# Altium schematic sheet ADC_DAC_Supply.SchDoc: RFSoC AMC
size 420 x 297 mm; CompanyName: WUT; DrawnBy: T. Przywozki; Organization: WUT ISE; Address1: Warsaw University of Technology; Address2: Nowowiejska 15/19 00-665 Warsaw; Address3: Tomasz.Przywozki@pw.edu.pl; DocumentNumber: 35; Revision: 1; SheetNumber: 35; SheetTotal: 45; Project: RFSoC AMC; ModifiedBy: T. Przywozki; CreateDate: -; CheckedDate: -; DivGrp: ISE; Designer: T. Przywozki; ModifiedDate: -; ProjectName: ADC/DAC MEZZANINE
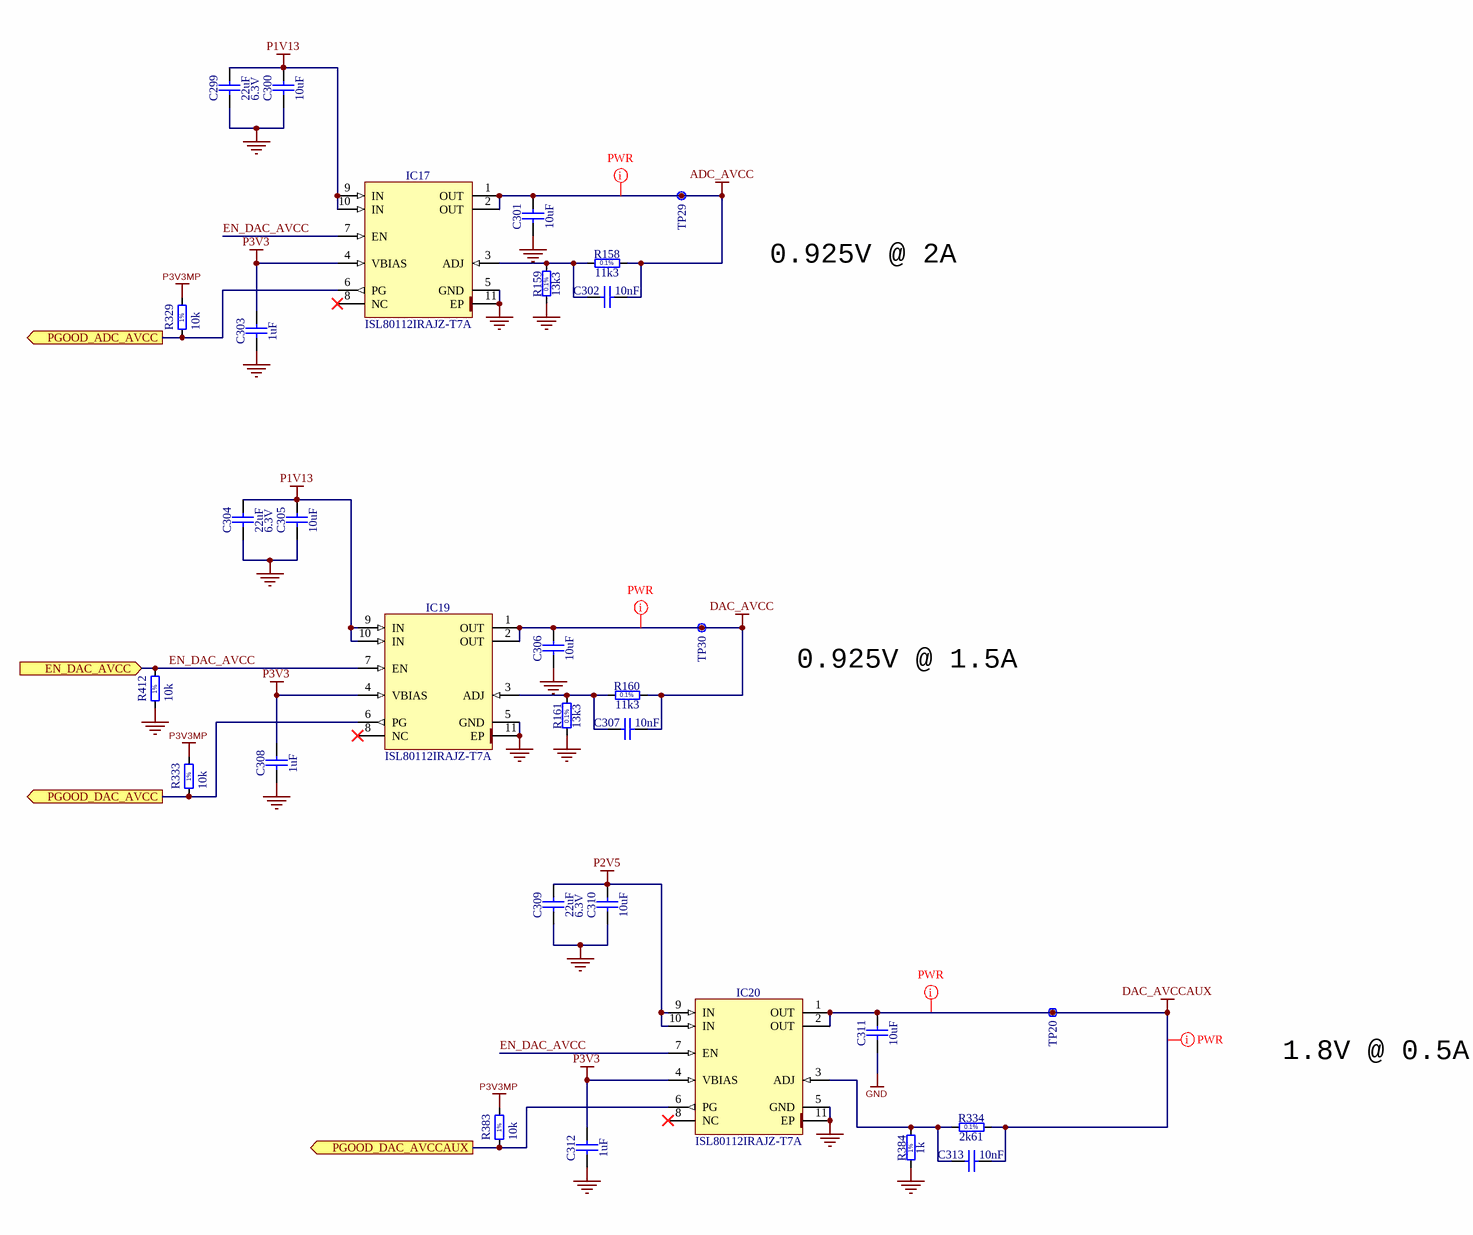
[diagram p0: ADC_DAC_Supply.SchDoc]

## Parts
C299  22uF  Voltage: 6.3V  [CAPC1709X100N]
C300  10uF  [CAPC1608X80N]
C301  10uF  [CAPC1608X80N]
C302  10nF  [CAPC1005X55N]
C303  1uF  [CAPC1005X55N]
C304  22uF  Voltage: 6.3V  [CAPC1709X100N]
C305  10uF  [CAPC1608X80N]
C306  10uF  [CAPC1608X80N]
C307  10nF  [CAPC1005X55N]
C308  1uF  [CAPC1005X55N]
C309  22uF  Voltage: 6.3V  [CAPC1709X100N]
C310  10uF  [CAPC1608X80N]
C311  10uF  [CAPC1608X80N]
C312  1uF  [CAPC1005X55N]
C313  10nF  [CAPC1005X55N]
IC17  ISL80112IRAJZ-T7A  [RENESAS_L10.3X3]
IC19  ISL80112IRAJZ-T7A  [RENESAS_L10.3X3]
IC20  ISL80112IRAJZ-T7A  [RENESAS_L10.3X3]
R158  11k3  [RESC2012X60N]
R159  13k3  [RESC2012X60N]
R160  11k3  [RESC2012X60N]
R161  13k3  [RESC2012X60N]
R329  10k  [RESC1005X40N]
R333  10k  [RESC1005X40N]
R334  2k61  [RESC1608X55N]
R383  10k  [RESC1005X40N]
R384  1k  [RESC1608X55N]
R412  10k  [RESC1005X40N]
TP20  Test Point  [TPS127]  (value not drawn)
TP29  Test Point  [TPS127]  (value not drawn)
TP30  Test Point  [TPS127]  (value not drawn)

## Ports
EN_DAC_AVCC (in), PGOOD_ADC_AVCC (out), PGOOD_DAC_AVCC (out), PGOOD_DAC_AVCCAUX (out)

## Nets
ADC_AVCC: C301.2 C302.2 IC17.1(OUT) IC17.2(OUT) R158.2 TP29.1
DAC_AVCC: C306.2 C307.2 IC19.1(OUT) IC19.2(OUT) R160.2 TP30.1
DAC_AVCCAUX: C311.2 C313.2 IC20.1(OUT) IC20.2(OUT) R334.2 TP20.1
GND: C299.1 C300.1 C301.1 C303.1 C304.1 C305.1 C306.1 C308.1 C309.1 C310.1 C311.1 C312.1 IC17.5(GND) IC17.11(EP) IC19.5(GND) IC19.11(EP) IC20.5(GND) IC20.11(EP) R159.1 R161.1 R384.1 R412.1
P1V13: C299.2 C300.2 C304.2 C305.2 IC17.9(IN) IC17.10(IN) IC19.9(IN) IC19.10(IN)
P2V5: C309.2 C310.2 IC20.9(IN) IC20.10(IN)
P3V3: C303.2 C308.2 C312.2 IC17.4(VBIAS) IC19.4(VBIAS) IC20.4(VBIAS)
P3V3MP: R329.2 R333.2 R383.2
EN_DAC_AVCC: IC17.7(EN) IC19.7(EN) IC20.7(EN) R412.2 ; port EN_DAC_AVCC
PGOOD_ADC_AVCC: IC17.6(PG) R329.1 ; port PGOOD_ADC_AVCC
PGOOD_DAC_AVCC: IC19.6(PG) R333.1 ; port PGOOD_DAC_AVCC
PGOOD_DAC_AVCCAUX: IC20.6(PG) R383.1 ; port PGOOD_DAC_AVCCAUX
NetC302_1: C302.1 IC17.3(ADJ) R158.1 R159.2
NetC307_1: C307.1 IC19.3(ADJ) R160.1 R161.2
NetC313_1: C313.1 IC20.3(ADJ) R334.1 R384.2

Not connected (* = marked no-connect by the designer): IC17 8(NC)*; IC19 8(NC)*; IC20 8(NC)*

## Layout directives
net class PWR: ADC_AVCC, DAC_AVCC, DAC_AVCCAUX

## Notes on the sheet
- 0.925V @ 2A
- 0.925V @ 1.5A
- 1.8V @ 0.5A
- Project/Equipment
- Document
- Designer
- Drawn by
- Check.by
- Copyright WUT ISE 2021
  This documentation describes Open Hardware and is licensed under CERN OHL v.1.1. You may redistribute and modify this documentaction under the terms of the CERN OHL v1.1.
  (http://ohwr.org/CERNOHL). This documentation is dristributed WITHOUT ANY EXPRESS OR IMPLIED WARRANTY, INCLUDING OF MERCHANTABLITY, SATISFACTORY QUALITY AND FITNESS FOR A PARTICULAR PURPOSE. Please see the CERN OHL v.1.1 for applicable conditions
- File
- Last Mod.
- Print Date
- Sheet
- Size
- A3
- of
- Rev
- Contact:
- (in symbol R0402_10K_1%_0.0625W_100PPM) 1%
- (in symbol R0603_1K_1%_0.1W_100PPM) 1%
- (in symbol R0603_2K61_0.1%_0.063W_10PPM) 0.1%
- (in symbol R0805_11K3_0.1%_0.1W_10PPM) 0.1%
- (in symbol R0805_13K3_0.1%_0.1W_10PPM) 0.1%

## Library data of the parts
C299 C304 C309 = CC0603_22UF_6.3V_20%_X5R: Non-polarised capacitor; Part Description: SMD Multilayer Chip Ceramic Capacitor; Manufacturer: GENERIC; Manufacturer1 Part Number: C1608X5R0J226M080AC; TC: X5R; Tolerance: ±20%; Part Number: CC0603_22UF_6.3V_20%_X5R; Component Kind: Standard; Component Type: Standard; Pin Count: 2; Value: 22uF; Status: None; Manufacturer Part Number: CC0603_22UF_6.3V_20%_X5R; Case: 0603; Mounted: Yes; Socket: No; SMD: Yes; Sense: No; Manufacturer1 Example: TDK; Manufacturer1 ComponentHeight: 1mm; HelpURL: \\cern.ch\dfs\Applications\Altium\Datasheets\CC0603_X5R_TDK_C.pdf; Author: CERN DEM JLC; CreateDate: 16.12.2013; LatestRevisionDate: 13.09.2016
C300 C301 C305 C306 C310 C311 = CC0603_10UF_10V_10%_X5R: Non-polarised capacitor; Part Description: SMD Multilayer Chip Ceramic Capacitor; Manufacturer: GENERIC; Manufacturer1 Part Number: GRM188R61A106KE69D; Voltage: 10V; TC: X5R; Tolerance: ±10%; Part Number: CC0603_10UF_10V_10%_X5R; Component Kind: Standard; Component Type: Standard; Pin Count: 2; Value: 10uF; Status: None; Manufacturer Part Number: CC0603_10UF_10V_10%_X5R; Case: 0603; Mounted: Yes; Socket: No; SMD: Yes; Sense: No; Manufacturer1 Example: MURATA; Manufacturer1 ComponentHeight: 0.8mm; HelpURL: \\cern.ch\dfs\Applications\Altium\Datasheets\CC0603_MURATA_GRM188R61A106KE69D.pdf; Author: CERN DEM JLC; CreateDate: 31.01.2017; LatestRevisionDate: 31.01.2017
C302 C307 C313 = CC0402_10NF_25V_10%_X7R: Non-polarised capacitor; Part Description: SMD Multilayer Chip Ceramic Capacitor; Manufacturer: GENERIC; Manufacturer1 Part Number: C1005X7R1E103KT; Voltage: 25V; TC: X7R; Tolerance: ±10%; Part Number: CC0402_10NF_25V_10%_X7R; Component Kind: Standard; Component Type: Standard; Pin Count: 2; Value: 10nF; Status: Preferred; Manufacturer Part Number: CC0402_10NF_25V_10%_X7R; Case: 0402; Mounted: Yes; Socket: No; SMD: Yes; Sense: No; Manufacturer1 Example: TDK; Manufacturer1 ComponentHeight: 0.55mm; HelpURL: \\cern.ch\dfs\Applications\Altium\Datasheets\CC0402_X7R_TDK_C.pdf; Author: CERN DEM JLC; CreateDate: 25.10.2012; LatestRevisionDate: 25.10.2012
C303 C308 C312 = CC0402_1UF_16V_10%_X5R: Non-polarised capacitor; Part Description: SMD Multilayer Chip Ceramic Capacitor; Manufacturer: GENERIC; Manufacturer1 Part Number: C1005X5R1C105KT; Voltage: 16V; TC: X5R; Tolerance: ±10%; Part Number: CC0402_1UF_16V_10%_X5R; Component Kind: Standard; Component Type: Standard; Pin Count: 2; Value: 1uF; Status: Preferred; Manufacturer Part Number: CC0402_1UF_16V_10%_X5R; Case: 0402; Mounted: Yes; Socket: No; SMD: Yes; Sense: No; Manufacturer1 Example: TDK; Manufacturer1 ComponentHeight: 0.55mm; HelpURL: \\cern.ch\dfs\Applications\Altium\Datasheets\CC0402_X5R_TDK_C.pdf; Author: CERN DEM JLC; CreateDate: 25.10.2012; LatestRevisionDate: 25.10.2012
IC17 IC19 IC20 = ISL80112IRAJZ-T7A: Ultra Low Dropout Low Input Voltage NMOS LDO Regulator; Part Description: 1V-3.6V to 0.8V-3.3V Ultra Low Dropout 2A Low Input Voltage NMOS LDO Regulator; Manufacturer: RENESAS ELECTRONICS; PressFit: No; Bonding: No; Part Number: ISL80112IRAJZ-T7A; Component Kind: Standard; Component Type: Standard; Device: ISL80112IRAJZ-T7A; PackageDescription: SON(DFN), 0.50mm Pitch, Square; 10 Pin, 3.00mm L X 3.00mm W X 1.00mm H body (w/Thermal Tab 1.60 x2.00mm); Manufacturer Part Number: ISL80112IRAJZ-T7A; Pin Count: 11; Case: SON10; Mounted: Yes; Socket: No; SMD: Yes; Sense: No; ComponentHeight: 1mm; HelpURL: \\cern.ch\dfs\Applications\Altium\Datasheets\ISL80112IRAJZ-T7A.pdf; Author: CERN DEM JLC; CreateDate: 04.12.2018; LatestRevisionDate: 04.12.2018
R158 R160 = R0805_11K3_0.1%_0.1W_10PPM: Resistor - 0.1%; Part Description: Thin Film Chip Resistor; Manufacturer: GENERIC; Manufacturer1 Part Number: RN73C2A11K3BTG; Power: 0.1W; TC: ±10ppm; PressFit: No; Part Number: R0805_11K3_0.1%_0.1W_10PPM; Component Kind: Standard; Component Type: Standard; Pin Count: 2; Value: 11k3; Status: Not Recommended; Tolerance: ±0.1%; Manufacturer Part Number: R0805_11K3_0.1%_0.1W_10PPM; Case: 0805; Mounted: Yes; Sense: No; Socket: No; SMD: Yes; Manufacturer1 Example: TYCO HOLSWORTHY; Manufacturer1 ComponentHeight: 0.6mm; HelpURL: \\cern.ch\dfs\Applications\Altium\Datasheets\R0805_Tyco_RN73.pdf; Author: CERN DEM JLC; CreateDate: 03.12.2007; LatestRevisionDate: 13.03.2008
R159 R161 = R0805_13K3_0.1%_0.1W_10PPM: Resistor - 0.1%; Part Description: Thin Film Chip Resistor; Manufacturer: GENERIC; Manufacturer1 Part Number: RN73C2A13K3BTG; Power: 0.1W; TC: ±10ppm; PressFit: No; Part Number: R0805_13K3_0.1%_0.1W_10PPM; Component Kind: Standard; Component Type: Standard; Pin Count: 2; Value: 13k3; Status: Not Recommended; Tolerance: ±0.1%; Manufacturer Part Number: R0805_13K3_0.1%_0.1W_10PPM; Case: 0805; Mounted: Yes; Sense: No; Socket: No; SMD: Yes; Manufacturer1 Example: TYCO HOLSWORTHY; Manufacturer1 ComponentHeight: 0.6mm; HelpURL: \\cern.ch\dfs\Applications\Altium\Datasheets\R0805_Tyco_RN73.pdf; Author: CERN DEM JLC; CreateDate: 03.12.2007; LatestRevisionDate: 13.03.2008
R329 R333 R383 R412 = R0402_10K_1%_0.0625W_100PPM: Resistor - 1%; Manufacturer: GENERIC; Part Description: General Purpose Thick Film Chip Resistor; Manufacturer1 Part Number: 232270671003L; TC: ±100ppm/°C; PressFit: No; Manufacturer Part Number: R0402_10K_1%_0.0625W_100PPM; Part Number: R0402_10K_1%_0.0625W_100PPM; Tolerance: ±1%; Value: 10k; Component Kind: Standard; Component Type: Standard; Pin Count: 2; Status: Not Recommended; Power: 0.0625W; Case: 0402; Mounted: Yes; Sense: No; Socket: No; SMD: Yes; Manufacturer1 Example: YAGEO PHYCOMP; Manufacturer1 ComponentHeight: 0.4mm; HelpURL: \\cern.ch\dfs\Applications\Altium\Datasheets\R0402_Phycomp_RC0402.pdf; Author: CERN DEM JLC; CreateDate: 03/12/2007; LatestRevisionDate: 17/10/2012
R334 = R0603_2K61_0.1%_0.063W_10PPM: Resistor - 0.1%; Part Description: Thin Film Chip Resistor; Manufacturer: GENERIC; Manufacturer1 Part Number: RN73C1J2K61BTDF; Power: 0.063W; TC: ±10ppm; PressFit: No; Part Number: R0603_2K61_0.1%_0.063W_10PPM; Component Kind: Standard; Component Type: Standard; Pin Count: 2; Value: 2k61; Status: Not Recommended; Tolerance: ±0.1%; Manufacturer Part Number: R0603_2K61_0.1%_0.063W_10PPM; Case: 0603; Mounted: Yes; Sense: No; Socket: No; SMD: Yes; Manufacturer1 Example: TYCO HOLSWORTHY; Manufacturer1 ComponentHeight: 0.5mm; HelpURL: \\cern.ch\dfs\Applications\Altium\Datasheets\R0603_Tyco_RN73.pdf; Author: CERN DEM JLC; CreateDate: 03.12.2007; LatestRevisionDate: 13.03.2008
R384 = R0603_1K_1%_0.1W_100PPM: Resistor - 1%; Part Description: General Purpose Thick Film Chip Resistor; Manufacturer: GENERIC; Manufacturer1 Part Number: NRC06F1001TRF; Power: 0.1W; TC: ±100ppm/°C; PressFit: No; Part Number: R0603_1K_1%_0.1W_100PPM; Component Kind: Standard; Component Type: Standard; Pin Count: 2; Value: 1k; Status: Preferred; Tolerance: ±1%; Manufacturer Part Number: R0603_1K_1%_0.1W_100PPM; Case: 0603; Mounted: Yes; Sense: No; Socket: No; SMD: Yes; Manufacturer1 Example: NIC COMPONENT; Manufacturer1 ComponentHeight: 0.55mm; HelpURL: \\cern.ch\dfs\Applications\Altium\Datasheets\R0603_NIC_NRC.pdf; Author: CERN DEM JLC; CreateDate: 03.12.2007; LatestRevisionDate: 13.03.2008
TP20 TP29 TP30 = SMD_PAD_1.27X1.27MM: Part Description: 1.27mm x 1.27mm PCB Copper Area (SMD Test Point); Mounted: No; Part Number: SMD_PAD_1.27X1.27MM; Component Kind: Standard (No BOM); Component Type: Standard (No BOM); Pin Count: 1; Family: Test Point; Socket: No; SMD: Yes; Sense: No; Status: None; ComponentHeight: 0mm; HelpURL: Undefined; Author: CERN DEM JLC; CreateDate: 12.01.2008; LatestRevisionDate: 12.01.2008; PackageDescription: 1.27mm x 1.27mm PCB Copper Area (SMD Test Point)